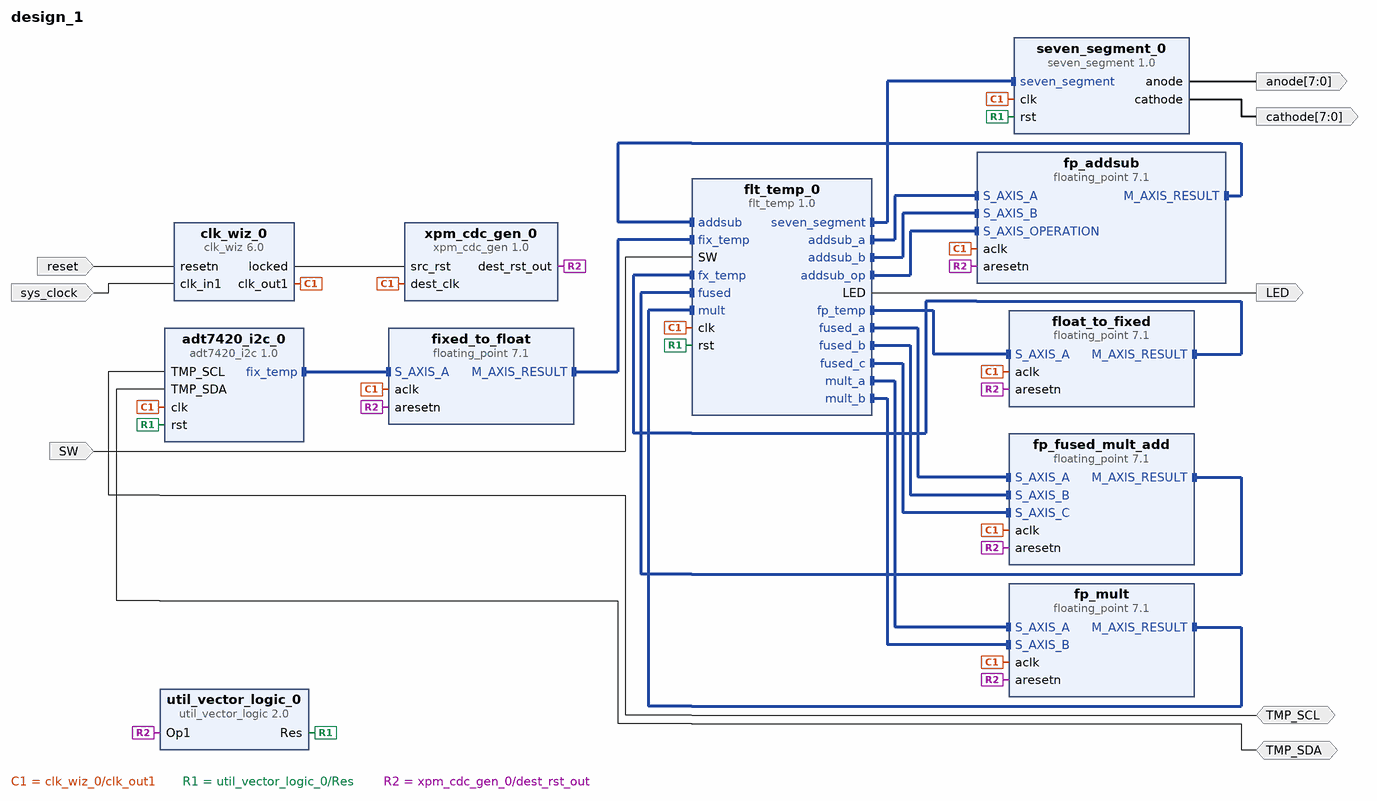
[diagram p0: block diagram of the top level]
# Vivado block design design_1, xc7a100tcsg324-1, Vivado 2022.2
create_bd_design design_1

create_bd_port -dir I -type clk sys_clock
set_property -dict {CONFIG.FREQ_HZ 100000000 CONFIG.PHASE 0.0} [get_bd_ports sys_clock]
create_bd_port -dir I -type rst reset
set_property -dict {CONFIG.POLARITY ACTIVE_LOW} [get_bd_ports reset]
create_bd_port -dir IO TMP_SCL
create_bd_port -dir IO TMP_SDA
create_bd_port -dir O -from 7 -to 0 anode
create_bd_port -dir O -from 7 -to 0 cathode
create_bd_port -dir I SW
create_bd_port -dir O LED

create_bd_cell -type ip -vlnv xilinx.com:ip:floating_point:7.1 fixed_to_float
set_property -dict [list \
  CONFIG.A_Precision_Type Custom \
  CONFIG.C_A_Exponent_Width 9 \
  CONFIG.C_A_Fraction_Width 4 \
  CONFIG.C_Accum_Input_Msb 32 \
  CONFIG.C_Accum_Lsb -31 \
  CONFIG.C_Accum_Msb 32 \
  CONFIG.C_Latency 6 \
  CONFIG.C_Mult_Usage No_Usage \
  CONFIG.C_Rate 1 \
  CONFIG.C_Result_Exponent_Width 8 \
  CONFIG.C_Result_Fraction_Width 24 \
  CONFIG.Flow_Control NonBlocking \
  CONFIG.Has_ARESETn true \
  CONFIG.Has_RESULT_TREADY false \
  CONFIG.Operation_Type Fixed_to_float \
  CONFIG.Result_Precision_Type Single \
] [get_bd_cells fixed_to_float]
create_bd_cell -type ip -vlnv xilinx.com:ip:floating_point:7.1 float_to_fixed
set_property -dict [list \
  CONFIG.C_Latency 6 \
  CONFIG.C_Mult_Usage No_Usage \
  CONFIG.C_Rate 1 \
  CONFIG.C_Result_Exponent_Width 12 \
  CONFIG.C_Result_Fraction_Width 4 \
  CONFIG.Flow_Control NonBlocking \
  CONFIG.Has_ARESETn true \
  CONFIG.Has_RESULT_TREADY false \
  CONFIG.Operation_Type Float_to_fixed \
  CONFIG.Result_Precision_Type Custom \
] [get_bd_cells float_to_fixed]
create_bd_cell -type ip -vlnv xilinx.com:ip:floating_point:7.1 fp_addsub
set_property -dict [list \
  CONFIG.A_Precision_Type Single \
  CONFIG.C_Latency 11 \
  CONFIG.Flow_Control NonBlocking \
  CONFIG.Has_ARESETn true \
  CONFIG.Has_RESULT_TREADY false \
] [get_bd_cells fp_addsub]
create_bd_cell -type ip -vlnv xilinx.com:ip:floating_point:7.1 fp_fused_mult_add
set_property -dict [list \
  CONFIG.A_Precision_Type Single \
  CONFIG.Add_Sub_Value Add \
  CONFIG.C_Latency 19 \
  CONFIG.C_Mult_Usage Full_Usage \
  CONFIG.C_Rate 1 \
  CONFIG.C_Result_Exponent_Width 8 \
  CONFIG.C_Result_Fraction_Width 24 \
  CONFIG.Flow_Control NonBlocking \
  CONFIG.Has_ARESETn true \
  CONFIG.Has_RESULT_TREADY false \
  CONFIG.Operation_Type FMA \
  CONFIG.Result_Precision_Type Single \
] [get_bd_cells fp_fused_mult_add]
create_bd_cell -type ip -vlnv xilinx.com:ip:floating_point:7.1 fp_mult
set_property -dict [list \
  CONFIG.A_Precision_Type Single \
  CONFIG.C_Latency 8 \
  CONFIG.C_Mult_Usage Full_Usage \
  CONFIG.C_Rate 1 \
  CONFIG.C_Result_Exponent_Width 8 \
  CONFIG.C_Result_Fraction_Width 24 \
  CONFIG.Flow_Control NonBlocking \
  CONFIG.Has_ARESETn true \
  CONFIG.Has_RESULT_TREADY false \
  CONFIG.Operation_Type Multiply \
  CONFIG.Result_Precision_Type Single \
] [get_bd_cells fp_mult]
create_bd_cell -type ip -vlnv xilinx.com:ip:clk_wiz:6.0 clk_wiz_0
set_property -dict [list \
  CONFIG.CLK_IN1_BOARD_INTERFACE sys_clock \
  CONFIG.RESET_BOARD_INTERFACE reset \
  CONFIG.RESET_PORT resetn \
  CONFIG.RESET_TYPE ACTIVE_LOW \
  CONFIG.USE_BOARD_FLOW true \
] [get_bd_cells clk_wiz_0]
create_bd_cell -type ip -vlnv xilinx.com:ip:xpm_cdc_gen:1.0 xpm_cdc_gen_0
set_property -dict {CONFIG.CDC_TYPE xpm_cdc_sync_rst} [get_bd_cells xpm_cdc_gen_0]
create_bd_cell -type ip -vlnv packpub.com:user:seven_segment:1.0 seven_segment_0
create_bd_cell -type ip -vlnv xilinx.com:ip:util_vector_logic:2.0 util_vector_logic_0
set_property -dict {CONFIG.C_OPERATION not CONFIG.C_SIZE 1} [get_bd_cells util_vector_logic_0]
create_bd_cell -type ip -vlnv xilinx.com:user:adt7420_i2c:1.0 adt7420_i2c_0
set_property -dict {CONFIG.INTERVAL 1000000000} [get_bd_cells adt7420_i2c_0]
create_bd_cell -type ip -vlnv xilinx.com:user:flt_temp:1.0 flt_temp_0

# ---- connections ----

connect_bd_intf_net [get_bd_intf_pins adt7420_i2c_0/fix_temp] [get_bd_intf_pins fixed_to_float/S_AXIS_A]
connect_bd_intf_net [get_bd_intf_pins fixed_to_float/M_AXIS_RESULT] [get_bd_intf_pins flt_temp_0/fix_temp]
connect_bd_intf_net [get_bd_intf_pins float_to_fixed/M_AXIS_RESULT] [get_bd_intf_pins flt_temp_0/fx_temp]
connect_bd_intf_net [get_bd_intf_pins flt_temp_0/addsub_a] [get_bd_intf_pins fp_addsub/S_AXIS_A]
connect_bd_intf_net [get_bd_intf_pins flt_temp_0/addsub_b] [get_bd_intf_pins fp_addsub/S_AXIS_B]
connect_bd_intf_net [get_bd_intf_pins flt_temp_0/addsub_op] [get_bd_intf_pins fp_addsub/S_AXIS_OPERATION]
connect_bd_intf_net [get_bd_intf_pins flt_temp_0/fp_temp] [get_bd_intf_pins float_to_fixed/S_AXIS_A]
connect_bd_intf_net [get_bd_intf_pins flt_temp_0/fused_a] [get_bd_intf_pins fp_fused_mult_add/S_AXIS_A]
connect_bd_intf_net [get_bd_intf_pins flt_temp_0/fused_b] [get_bd_intf_pins fp_fused_mult_add/S_AXIS_B]
connect_bd_intf_net [get_bd_intf_pins flt_temp_0/fused_c] [get_bd_intf_pins fp_fused_mult_add/S_AXIS_C]
connect_bd_intf_net [get_bd_intf_pins flt_temp_0/mult_a] [get_bd_intf_pins fp_mult/S_AXIS_A]
connect_bd_intf_net [get_bd_intf_pins flt_temp_0/mult_b] [get_bd_intf_pins fp_mult/S_AXIS_B]
connect_bd_intf_net [get_bd_intf_pins flt_temp_0/seven_segment] [get_bd_intf_pins seven_segment_0/seven_segment]
connect_bd_intf_net [get_bd_intf_pins fp_addsub/M_AXIS_RESULT] [get_bd_intf_pins flt_temp_0/addsub]
connect_bd_intf_net [get_bd_intf_pins fp_fused_mult_add/M_AXIS_RESULT] [get_bd_intf_pins flt_temp_0/fused]
connect_bd_intf_net [get_bd_intf_pins flt_temp_0/mult] [get_bd_intf_pins fp_mult/M_AXIS_RESULT]
connect_bd_net [get_bd_ports TMP_SCL] [get_bd_pins adt7420_i2c_0/TMP_SCL]
connect_bd_net [get_bd_ports TMP_SDA] [get_bd_pins adt7420_i2c_0/TMP_SDA]
connect_bd_net -net SW_0_1 [get_bd_ports SW] [get_bd_pins flt_temp_0/SW]
connect_bd_net [get_bd_pins clk_wiz_0/clk_out1] \
  [get_bd_pins fixed_to_float/aclk] [get_bd_pins float_to_fixed/aclk] [get_bd_pins fp_addsub/aclk] [get_bd_pins fp_mult/aclk] \
  [get_bd_pins fp_fused_mult_add/aclk] [get_bd_pins xpm_cdc_gen_0/dest_clk] [get_bd_pins seven_segment_0/clk] \
  [get_bd_pins adt7420_i2c_0/clk] [get_bd_pins flt_temp_0/clk]
connect_bd_net [get_bd_pins clk_wiz_0/locked] [get_bd_pins xpm_cdc_gen_0/src_rst]
connect_bd_net [get_bd_pins flt_temp_0/LED] [get_bd_ports LED]
connect_bd_net [get_bd_ports reset] [get_bd_pins clk_wiz_0/resetn]
connect_bd_net -net reset_sync [get_bd_pins util_vector_logic_0/Res] \
  [get_bd_pins seven_segment_0/rst] [get_bd_pins adt7420_i2c_0/rst] [get_bd_pins flt_temp_0/rst]
connect_bd_net -net reset_sync_n [get_bd_pins xpm_cdc_gen_0/dest_rst_out] \
  [get_bd_pins fp_addsub/aresetn] [get_bd_pins fp_fused_mult_add/aresetn] [get_bd_pins fp_mult/aresetn] \
  [get_bd_pins fixed_to_float/aresetn] [get_bd_pins float_to_fixed/aresetn] [get_bd_pins util_vector_logic_0/Op1]
connect_bd_net [get_bd_pins seven_segment_0/anode] [get_bd_ports anode]
connect_bd_net [get_bd_pins seven_segment_0/cathode] [get_bd_ports cathode]
connect_bd_net [get_bd_ports sys_clock] [get_bd_pins clk_wiz_0/clk_in1]

validate_bd_design
save_bd_design
